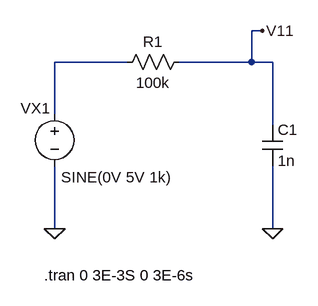
[diagram p0: schematic Cópia de Ex_03_AnaliseTRAN.asc]
Cópia de Ex_03_AnaliseTRAN.asc, the LTspice schematic file:
Version 4
SHEET 1 960 680
WIRE 144 16 128 16
WIRE -64 64 -176 64
WIRE 128 64 128 16
WIRE 128 64 16 64
WIRE 160 64 128 64
WIRE -176 144 -176 64
WIRE 160 160 160 64
WIRE -176 320 -176 224
WIRE 160 320 160 224
FLAG -176 320 0
FLAG 160 320 0
FLAG 144 16 V11
SYMBOL res 32 48 R90
WINDOW 0 0 56 VBottom 0
WINDOW 3 32 56 VTop 0
SYMATTR InstName R1
SYMATTR Value 100k
SYMBOL voltage -176 128 R0
WINDOW 123 0 0 Left 0
WINDOW 39 0 0 Left 0
WINDOW 0 -52 7 Left 0
WINDOW 3 10 113 Left 0
SYMATTR InstName VX1
SYMATTR Value SINE(0V 5V 1k)
SYMBOL cap 144 160 R0
SYMATTR InstName C1
SYMATTR Value 1n
TEXT -192 392 Left 0 !.tran 0 3E-3S 0 3E-6s

The netlist it stands for:
* Cópia de Ex_03_AnaliseTRAN.asc
R1 V11 N001 100k
VX1 N001 0 SINE(0V 5V 1k)
C1 V11 0 1n
.tran 0 3E-3S 0 3E-6s
.backanno
.end